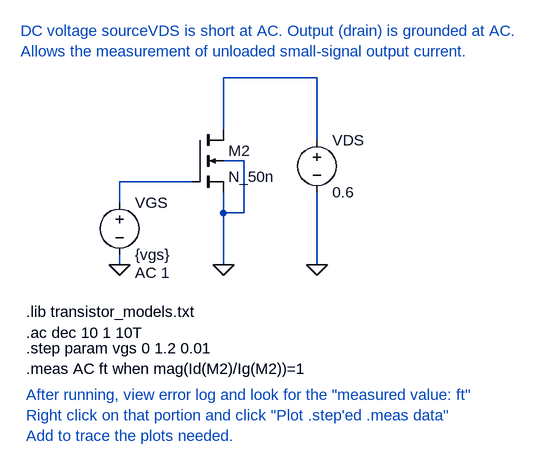
[diagram p0: schematic lab05_ft_extract.asc]
lab05_ft_extract.asc, the LTspice schematic file:
Version 4
SHEET 1 1112 680
WIRE 464 -64 320 -64
WIRE 320 16 320 -64
WIRE 464 32 464 -64
WIRE 352 64 320 64
WIRE 272 96 160 96
WIRE 160 128 160 96
WIRE 320 144 320 112
WIRE 352 144 352 64
WIRE 352 144 320 144
WIRE 160 224 160 208
WIRE 320 224 320 144
WIRE 464 224 464 112
FLAG 320 224 0
FLAG 464 224 0
FLAG 160 224 0
SYMBOL voltage 464 16 R0
WINDOW 123 0 0 Left 0
WINDOW 39 0 0 Left 0
SYMATTR InstName VDS
SYMATTR Value 0.6
SYMBOL voltage 160 112 R0
WINDOW 123 24 124 Left 2
WINDOW 39 0 0 Left 0
SYMATTR Value2 AC 1
SYMATTR InstName VGS
SYMATTR Value {vgs}
SYMBOL nmos4 272 16 R0
SYMATTR InstName M2
SYMATTR Value N_50n
SYMATTR Value2 l=1u w=10u
TEXT 16 296 Left 2 !.lib transistor_models.txt
TEXT 16 328 Left 2 !.ac dec 10 1 10T
TEXT 16 384 Left 2 !.meas AC ft when mag(Id(M2)/Ig(M2))=1
TEXT 8 -136 Left 2 ;DC voltage sourceVDS is short at AC. Output (drain) is grounded at AC.\nAllows the measurement of unloaded small-signal output current.
TEXT 16 424 Left 2 ;After running, view error log and look for the "measured value: ft"\nRight click on that portion and click "Plot .step'ed .meas data"\nAdd to trace the plots needed.
TEXT 16 352 Left 2 !.step param vgs 0 1.2 0.01

The netlist it stands for:
* lab05_ft_extract.asc
VDS N001 0 0.6
VGS N002 0 {vgs} AC 1
M2 N001 N002 0 0 N_50n l=1u w=10u
.model NMOS NMOS
.model PMOS PMOS
.lib standard.mos
.lib transistor_models.txt
.ac dec 10 1 10T
.meas AC ft when mag(Id(M2)/Ig(M2))=1
* DC voltage sourceVDS is short at AC. Output (drain) is grounded at AC.
* Allows the measurement of unloaded small-signal output current.
* After running, view error log and look for the "measured value: ft"
* Right click on that portion and click "Plot .step'ed .meas data"
* Add to trace the plots needed.
.step param vgs 0 1.2 0.01
.backanno
.end